# Altium schematic sheet 10-Programmer.SchDoc: ECE315 Analog
size A; Date: 4/25/2017; ApprovedBy: JSK; CheckedBy: JSK; Author: JSK; CompanyName: University of Wisconsin; DrawnBy: JSK; Engineer: JSK; Organization: ECE 315; Address1: College of Engineering; Address2: 1415 Engineering Drive; Address3: Madison, WI 53706; Address4: ECE 315 Fall 2017; Revision: A; SheetNumber: 10; SheetTotal: 10; AssemblyNumber: ECE315-F19; ApprovedDate: 04/02/2019; ECE315_Project_Name: ECE353 F23 Wack-A-Mole
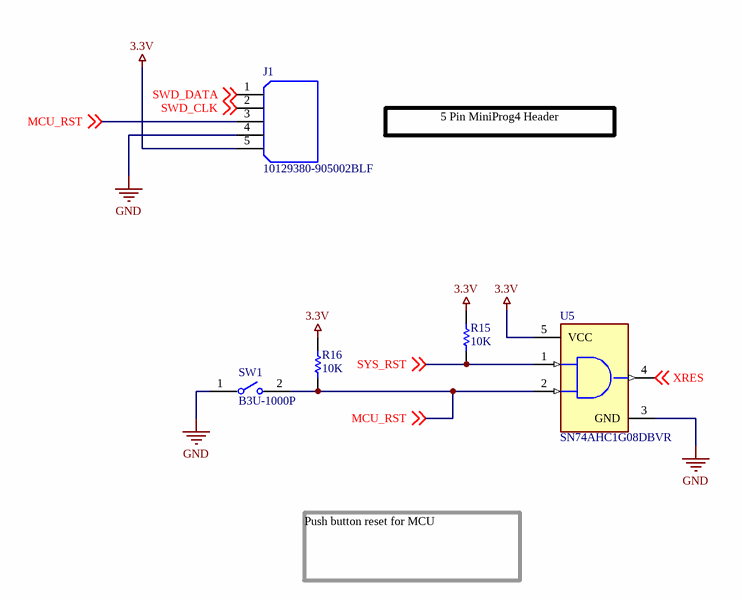
[diagram p0: 10-Programmer.SchDoc]

## Parts
J1  10129380-905002BLF  [AMPHENOL_10129380-905002BLF]
R15  Resistance: 10K  [RESC3116X65X40ML10T20]  (hidden comment: RC1206FR-0710KL)
R16  Resistance: 10K  [RESC3116X65X40ML10T20]  (hidden comment: RC1206FR-0710KL)
SW1  B3U-1000P  [FP-B3U-1000P-MFG]
U5  SN74AHC1G08DBVR  [FP-DBV0005A-MFG]

## Nets
3.3V: J1.5 R15.2 R16.2 U5.5(VCC)
GND: J1.4 SW1.1 U5.3(GND)
MCU_RST: J1.3 R16.1 SW1.2 U5.2(B) ; off-sheet MCU_RST
SWD_CLK: J1.2 ; off-sheet SWD_CLK
SWD_DATA: J1.1 ; off-sheet SWD_DATA
SYS_RST: R15.1 U5.1(A) ; off-sheet SYS_RST
XRES: U5.4(Y) ; off-sheet XRES

## Notes on the sheet
- 5 Pin MiniProg4 Header
- Push button reset for MCU
- Title:
- Size:
- A
- Project
- Rev:
- Sheet:
- of
- College of Engineering
- 1415 Engineering Drive
- Madison, WI 53706

## Library data of the parts
J1 = 10129380-905002BLF: Conn Unshrouded Header HDR 5 POS 2.54mm Solder ST SMD Poly Bag; Manufacturer 1: ICC; MF: AMPHENOL ICC / FCI; Package: None; Price: None; Check_prices: https://www.snapeda.com/parts/10129380-905002BLF/Amphenol/view-part/?ref=eda; Value: *; SnapEDA_Link: https://www.snapeda.com/parts/10129380-905002BLF/Amphenol/view-part/?ref=snap; MP: 10129380-905002BLF; Availability: In Stock; Purchase-URL: https://pricing.snapeda.com/search/part/10129380-905002BLF/?ref=eda; Supplier 1: Digi-Key; Supplier Part Number 1: 10129380-905002BLF-ND; Manufacturer Part Number 1: 10129380-905002BLF; RoHS: No
R15 R16 = CMP-1014-00623-2: Chip Resistor, 10 KOhm, +/- 1%, 0.25 W, -55 to 155 degC, 1206 (3216 Metric), RoHS, Tape and Reel; Manufacturer: Yageo; Voltage Rating: 200V; Temperature Coefficient: 100ppm/degreesC; Power Rating: 250mW; Packaging: TapeandReel; Termination: SMD/SMT; REACH SVHC: Unknown; Tolerance: 1%; Height: 0.55mm; Composition: ThickFilm; Max Operating Temperature: 155degC; Datasheet Version: Rev. 5, 10/2016; Lead Free: LeadFree; Case Code (Metric): 3216; Depth: 1.6mm; Package Quantity: 5000; RoHSCompliant: true; Military Standard: Not; Case/Package: 1206; Case Code (Imperial): 1206; Min Operating Temperature: -55degC; Datasheet URL: http://www.yageo.com/NewPortal/yageodocoutput?fileName=/pdf/R-Chip/PYu-RC_Group_51_RoHS_L_5.pdf; Length: 3.1mm; Manufacturer URL: http://www.yageo.com/; Package Reference: 1206.0; Width: 1.6mm; Package Description: 2-Pin Surface Mount Device, Body 3.1 x 1.6 mm; Supplier 1: Digi-Key; Supplier Part Number 1: 311-10.0KFRCT-ND; Manufacturer Part Number: RC1206FR-0710KL; RoHS: Yes; Category: Chip SMD Resistors; Stock 1: 3827063; Pricing 1: 1=0.10000, 10=0.03700, 100=0.02040, 1000=0.01236, 2500=0.01036 (USD); Size Code: 1206; Series: RC; Resistance Tolerance: 1%; Resistor Type: Thick Film; Max Power Dissipation: 250mW; Number of Terminations: 2; Construction: Rectangular; Features: Moisture Resistant; RoHS Compliant: Yes; ComponentLink1URL: https://datasheet.ciiva.com/46445/444357-46445703.pdf?src-supplier=Element14; ComponentLink1Description: https://datasheet.ciiva.com/46445/444357-46445703.pdf?src-supplier=Element14; ComponentLink2URL: https://datasheet.ciiva.com/7857/1692832-7857244.pdf?src-supplier=Element14; ComponentLink2Description: https://datasheet.ciiva.com/7857/1692832-7857244.pdf?src-supplier=Element14; ComponentLink3URL: https://datasheet.ciiva.com/7857/1692832-7857245.pdf?src-supplier=Element14; ComponentLink3Description: https://datasheet.ciiva.com/7857/1692832-7857245.pdf?src-supplier=Element14; Supplier 2: Newark; Supplier Part Number 2: 98K7621
SW1 = CMP-2100-03586-2: SWITCH TACTILE SPST-NO 0.05A 12V; Manufacturer: Omron; Contact Resistance: 100mR; Operating Force: 1.5N; Max Current Rating: 50mA; Switch Travel: 0.15mm; Actuator Type: Standard; Mechanical Life: 200000Cycles; Ratings: Dust Proof; Illumination Type: Non-Illuminated; Throw Configuration: SPST; Actuator Length: 0.4mm; Switch Function: Off-Mom; Height: 1.2mm; Width: 3mm; Weight: 0.000776oz; Contact Material: Silver; Max Voltage Rating (DC): 12V; Insulation Resistance: 100MR; Lead Free: Lead Free; Current Rating: 50mA; Termination: SMD/SMT; Length: 4mm; Voltage Rating (DC): 12V; Contact Current Rating: 50mA; Orientation: Straight; Depth: 2.5mm; Max Operating Temperature: 70°C; Packaging: Tape and Reel; Min Operating Temperature: -25°C; Package Quantity: 1; Mount: Surface Mount; Electrical Life: 200000Cycles; Supplier: Digi-Key; Supplier Part Number: SW1020CT-ND; Manufacturer Part Number: B3U-1000P; RoHS: Yes; Category: Tactile Switches; Stock: 65266; Pricing: 1=1.02, 10=0.983, 25=0.9188, 100=0.7977, 250=0.72584, 500=0.67292, 1000=0.62377 (USD); Mounting Technology: Surface Mount; Series: B3U; RoHS Compliant: Yes; Reach SVHC Compliant: Unknown
U5 = CMP-0859-00043-4: IC GATE AND 1CH 2-INP SOT23-5; Manufacturer: Texas Instruments; Number Of Outputs: 1; Nominal Supply Current: 1uA; Standoff Height: 0mm; Max Supply Voltage: 5.5V; Min Supply Voltage: 2V; Max Junction Temp: +150°C; Propagation Delay: 5.8ns; Number Of Inputs: 2; Logic Function Desc: Non-Inverting; Output Current: 8mA; Logic Function: AND GATE; High Level Output Current: -8mA; Turn-On Delay Time: 12.3ns; Device Class L3: Logic Gates; Category: IC; ComponentLink2Description: Datasheet; Device Class L2: Logic ICs; RoHS: TRUE; Device Class L1: Integrated Circuits (ICs); Manufacturer Part Number: SN74AHC1G08DBVR; Temperature Range Low: -55°C; Number Of Circuits: 1; Automotive: No; Lead Free: Yes; Temperature Range High: +125°C; Digikey Description: IC GATE AND 1CH 2-INP SOT23-5; Ambient Temperature Range High: +125°C; Ambient Temperature Range Low: -55°C; Package: DBV0005A; Mouser Description: AND Gate 1-Element 2-IN CMOS 5-Pin SOT-23 AND Gate 1-Element 2-IN CMOS 5-Pin SOT-23 AND Gate 1-Element 2-IN CMOS 5-Pi...; ComponentLink2URL: http://www.ti.com/lit/ds/symlink/sn74ahc1g08.pdf; Height: 1.45mm; Temperature: -55°C to +125°C; Octopart: https://octopart.com/sn74ahc1g08dbvr-texas+instruments-464404; Supplier: Digi-Key; Supplier Part Number: 296-1091-1-ND; Stock: 156425; Pricing: 1=0.34, 10=0.25, 25=0.2184, 100=0.1413, 250=0.117, 500=0.0936, 1000=0.07176 (USD); Mounting Technology: Surface Mount; Case/Package: SOT-23; Pins: 5; Weight: 0.000557oz; Min Operating Temperature: -55°C; Max Operating Temperature: 125°C; Number of Gates: 1; Packaging: Tape and Reel; Number of Elements: 1; Low Level Output Current: 8mA; Quiescent Current: 1uA; Series: 74AHC; Technology: CMOS; Package Quantity: 3000; Number of Bits: 1; Number of Input Lines: 2; Number of Output Lines: 1; Max Output current: 8mA; Termination: SMD/SMT; Length: 2.9mm; Width: 1.6mm; Radiation Hardening: No; Reach SVHC Compliant: No; RoHS Compliant: Yes